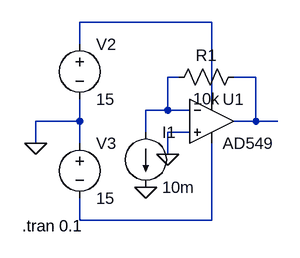
[diagram p0: schematic CurrenttoVoltage.asc]
CurrenttoVoltage.asc, the LTspice schematic file:
Version 4
SHEET 1 880 680
WIRE 192 -16 0 -16
WIRE 0 16 0 -16
WIRE 144 64 128 64
WIRE 256 64 224 64
WIRE 192 96 192 -16
WIRE 128 112 128 64
WIRE 128 112 96 112
WIRE 160 112 128 112
WIRE 0 128 0 96
WIRE 0 128 -64 128
WIRE 256 128 256 64
WIRE 256 128 224 128
WIRE 288 128 256 128
WIRE 96 144 96 112
WIRE 160 144 128 144
WIRE -64 160 -64 128
WIRE 0 160 0 128
WIRE 128 176 128 144
WIRE 0 272 0 240
WIRE 192 272 192 160
WIRE 192 272 0 272
FLAG 96 224 0
FLAG -64 160 0
FLAG 128 176 0
SYMBOL Opamps\\AD549 192 64 R0
SYMATTR InstName U1
SYMBOL voltage 0 0 R0
WINDOW 123 0 0 Left 0
WINDOW 39 0 0 Left 0
SYMATTR InstName V2
SYMATTR Value 15
SYMBOL voltage 0 144 R0
WINDOW 123 0 0 Left 0
WINDOW 39 0 0 Left 0
SYMATTR InstName V3
SYMATTR Value 15
SYMBOL res 240 48 R90
WINDOW 0 0 56 VBottom 2
WINDOW 3 32 56 VTop 2
SYMATTR InstName R1
SYMATTR Value 10k
SYMBOL current 96 144 R0
WINDOW 123 0 0 Left 0
WINDOW 39 0 0 Left 0
SYMATTR InstName I1
SYMATTR Value 10m
TEXT -84 280 Left 2 !.tran 0.1

The netlist it stands for:
* CurrenttoVoltage.asc
XU1 0 N002 N001 N004 N003 AD549  ; pins In+ In- V+ V- OUT
V2 N001 0 15
V3 0 N004 15
R1 N003 N002 10k
I1 N002 0 10m
.tran 0.1
.backanno
.end